# Altium schematic sheet main.SchDoc
size A4; SheetNumber: 1; SheetTotal: 1
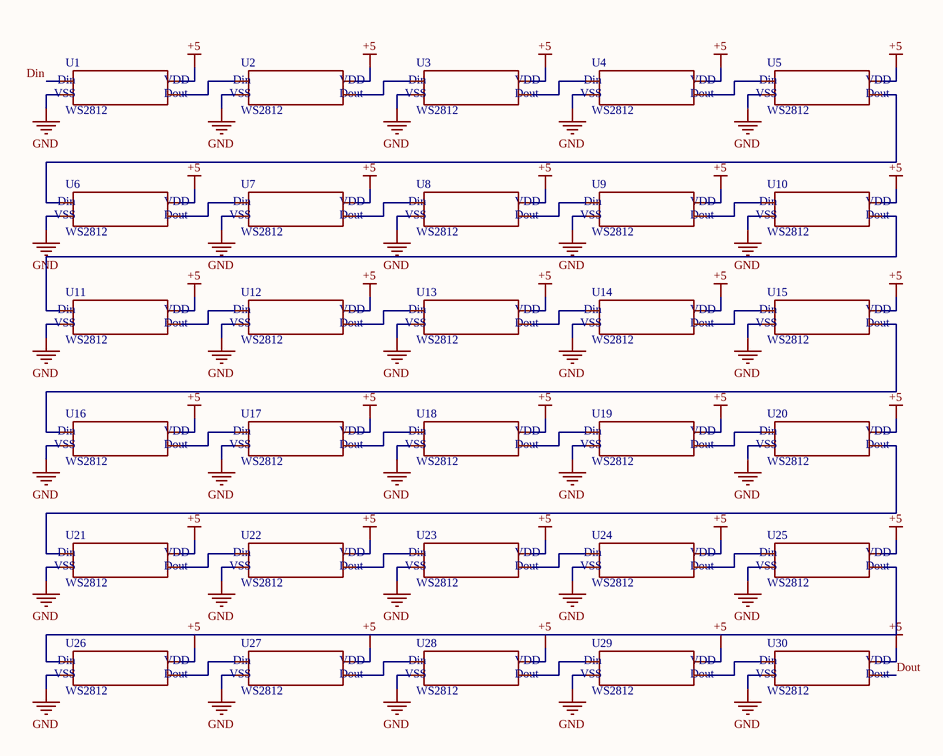
[diagram p0: main.SchDoc]

## Parts
U1  WS2812  [3535]
U2  WS2812  [3535]
U3  WS2812  [3535]
U4  WS2812  [3535]
U5  WS2812  [3535]
U6  WS2812  [3535]
U7  WS2812  [3535]
U8  WS2812  [3535]
U9  WS2812  [3535]
U10  WS2812  [3535]
U11  WS2812  [3535]
U12  WS2812  [3535]
U13  WS2812  [3535]
U14  WS2812  [3535]
U15  WS2812  [3535]
U16  WS2812  [3535]
U17  WS2812  [3535]
U18  WS2812  [3535]
U19  WS2812  [3535]
U20  WS2812  [3535]
U21  WS2812  [3535]
U22  WS2812  [3535]
U23  WS2812  [3535]
U24  WS2812  [3535]
U25  WS2812  [3535]
U26  WS2812  [3535]
U27  WS2812  [3535]
U28  WS2812  [3535]
U29  WS2812  [3535]
U30  WS2812  [3535]

## Nets
+5: U1.1 U2.1 U3.1 U4.1 U5.1 U6.1 U7.1 U8.1 U9.1 U10.1 U11.1 U12.1 U13.1 U14.1 U15.1 U16.1 U17.1 U18.1 U19.1 U20.1 U21.1 U22.1 U23.1 U24.1 U25.1 U26.1 U27.1 U28.1 U29.1 U30.1
GND: U1.3 U2.3 U3.3 U4.3 U5.3 U6.3 U7.3 U8.3 U9.3 U10.3 U11.3 U12.3 U13.3 U14.3 U15.3 U16.3 U17.3 U18.3 U19.3 U20.3 U21.3 U22.3 U23.3 U24.3 U25.3 U26.3 U27.3 U28.3 U29.3 U30.3
Din: U1.4
Dout: U30.2
NetU1_2: U1.2 U2.4
NetU2_2: U2.2 U3.4
NetU3_2: U3.2 U4.4
NetU4_2: U4.2 U5.4
NetU5_2: U5.2 U6.4
NetU6_2: U6.2 U7.4
NetU7_2: U7.2 U8.4
NetU8_2: U8.2 U9.4
NetU9_2: U9.2 U10.4
NetU10_2: U10.2 U11.4
NetU11_2: U11.2 U12.4
NetU12_2: U12.2 U13.4
NetU13_2: U13.2 U14.4
NetU14_2: U14.2 U15.4
NetU15_2: U15.2 U16.4
NetU16_2: U16.2 U17.4
NetU17_2: U17.2 U18.4
NetU18_2: U18.2 U19.4
NetU19_2: U19.2 U20.4
NetU20_2: U20.2 U21.4
NetU21_2: U21.2 U22.4
NetU22_2: U22.2 U23.4
NetU23_2: U23.2 U24.4
NetU24_2: U24.2 U25.4
NetU25_2: U25.2 U26.4
NetU26_2: U26.2 U27.4
NetU27_2: U27.2 U28.4
NetU28_2: U28.2 U29.4
NetU29_2: U29.2 U30.4

## Notes on the sheet
- (in symbol 芯片/IC-WS2812) Din; VDD; VSS; Dout

## Library data of the parts
U1-U30 = 芯片/IC-WS2812